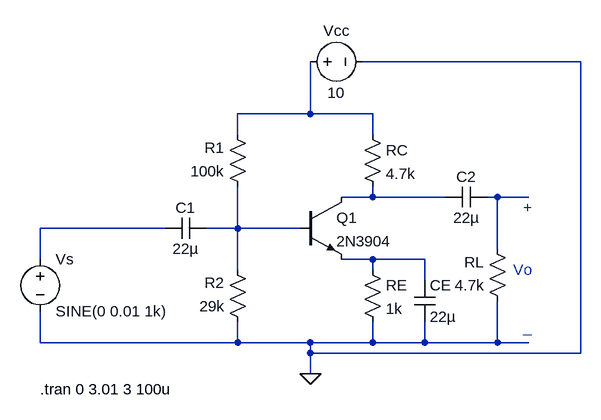
[diagram p0: schematic Lab9.asc]
Lab9.asc, the LTspice schematic file:
Version 4
SHEET 1 880 680
WIRE 832 -80 496 -80
WIRE 416 0 416 -80
WIRE 416 0 304 0
WIRE 512 0 416 0
WIRE 304 32 304 0
WIRE 512 32 512 0
WIRE 512 128 512 112
WIRE 512 128 464 128
WIRE 624 128 512 128
WIRE 704 128 688 128
WIRE 752 128 704 128
WIRE 192 176 0 176
WIRE 304 176 304 112
WIRE 304 176 256 176
WIRE 400 176 304 176
WIRE 704 208 704 128
WIRE 0 224 0 176
WIRE 512 224 464 224
WIRE 592 224 512 224
WIRE 304 240 304 176
WIRE 512 240 512 224
WIRE 592 256 592 224
WIRE 0 352 0 304
WIRE 304 352 304 320
WIRE 304 352 0 352
WIRE 416 352 304 352
WIRE 512 352 512 320
WIRE 512 352 416 352
WIRE 592 352 592 320
WIRE 592 352 512 352
WIRE 704 352 704 288
WIRE 704 352 592 352
WIRE 752 352 704 352
WIRE 416 368 416 352
WIRE 832 368 832 -80
WIRE 832 368 416 368
WIRE 416 400 416 368
FLAG 416 400 0
SYMBOL cap 256 160 R90
WINDOW 0 0 32 VBottom 2
WINDOW 3 32 32 VTop 2
SYMATTR InstName C1
SYMATTR Value 22µ
SYMBOL cap 624 144 R270
WINDOW 0 32 32 VTop 2
WINDOW 3 0 32 VBottom 2
SYMATTR InstName C2
SYMATTR Value 22µ
SYMBOL res 320 128 R180
WINDOW 0 36 76 Left 2
WINDOW 3 36 40 Left 2
SYMATTR InstName R1
SYMATTR Value 100k
SYMBOL res 320 336 R180
WINDOW 0 36 76 Left 2
WINDOW 3 36 40 Left 2
SYMATTR InstName R2
SYMATTR Value 29k
SYMBOL res 496 224 R0
SYMATTR InstName RE
SYMATTR Value 1k
SYMBOL res 496 16 R0
SYMATTR InstName RC
SYMATTR Value 4.7k
SYMBOL npn 400 128 R0
SYMATTR InstName Q1
SYMATTR Value 2N3904
SYMBOL voltage 400 -80 R270
WINDOW 0 32 56 VTop 2
WINDOW 3 -32 56 VBottom 2
SYMATTR InstName Vcc
SYMATTR Value 10
SYMBOL voltage 0 208 R0
WINDOW 123 0 0 Left 2
WINDOW 39 0 0 Left 2
SYMATTR InstName Vs
SYMATTR Value SINE(0 0.01 1k)
SYMBOL res 720 304 R180
WINDOW 0 36 76 Left 2
WINDOW 3 36 40 Left 2
SYMATTR InstName RL
SYMATTR Value 4.7k
SYMBOL cap 576 256 R0
SYMATTR InstName CE
SYMATTR Value 22µ
TEXT 728 240 Left 2 ;Vo
TEXT 744 144 Left 2 ;+
TEXT 744 328 Left 2 ;_
TEXT 0 424 Left 2 !.tran 0 3.01 3 100u

The netlist it stands for:
* Lab9.asc
C1 N005 N004 22µ
C2 N002 N003 22µ
R1 N005 N001 100k
R2 0 N005 29k
RE N006 0 1k
RC N001 N002 4.7k
Q1 N002 N005 N006 0 2N3904
Vcc N001 0 10
Vs N004 0 SINE(0 0.01 1k)
RL 0 N003 4.7k
CE N006 0 22µ
.model NPN NPN
.model PNP PNP
.lib standard.bjt
* Vo
* +
* _
.tran 0 3.01 3 100u
.backanno
.end